# Altium project sub_button.PrjPcb
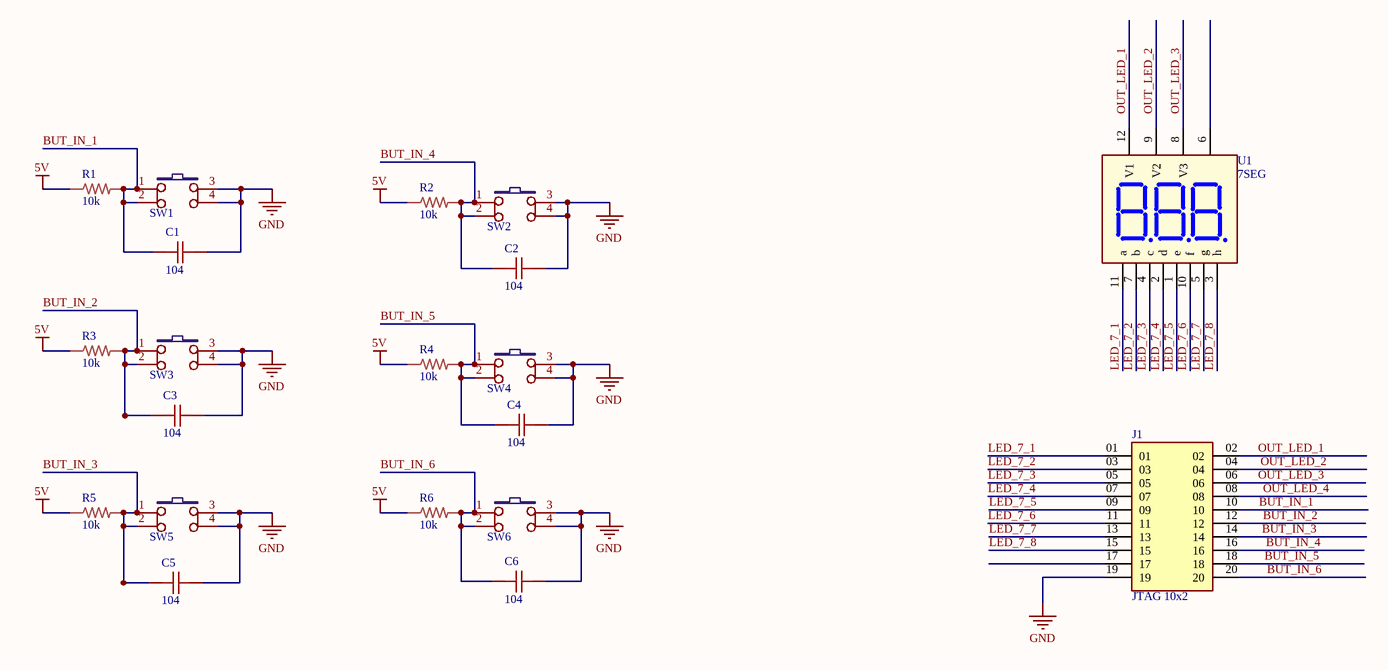
[diagram p0: SCH_SUB_BUTTON.SchDoc]
1 sheet, 20 parts. Net scope: global (net labels, ports and power ports of the same name join across sheets).
Board file: PCB_SUB_BUTTON.PcbDoc

## Sheet SCH_SUB_BUTTON.SchDoc
size A3

### Parts
C1  value 104  [CAP_SMD_1206]  (hidden comment: Cap_SMD)
C2  value 104  [CAP_SMD_1206]  (hidden comment: Cap_SMD)
C3  value 104  [CAP_SMD_1206]  (hidden comment: Cap_SMD)
C4  value 104  [CAP_SMD_1206]  (hidden comment: Cap_SMD)
C5  value 104  [CAP_SMD_1206]  (hidden comment: Cap_SMD)
C6  value 104  [CAP_SMD_1206]  (hidden comment: Cap_SMD)
J1  JTAG 10x2  [JTAG]
R1  value 10k  [Res_SMD_1206]  (hidden comment: Res_SMD)
R2  value 10k  [Res_SMD_1206]  (hidden comment: Res_SMD)
R3  value 10k  [Res_SMD_1206]  (hidden comment: Res_SMD)
R4  value 10k  [Res_SMD_1206]  (hidden comment: Res_SMD)
R5  value 10k  [Res_SMD_1206]  (hidden comment: Res_SMD)
R6  value 10k  [Res_SMD_1206]  (hidden comment: Res_SMD)
SW1  Button6x6  [Button6x6smd]  (value not drawn)
SW2  Button6x6  [Button6x6smd]  (value not drawn)
SW3  Button6x6  [Button6x6smd]  (value not drawn)
SW4  Button6x6  [Button6x6smd]  (value not drawn)
SW5  Button6x6  [Button6x6smd]  (value not drawn)
SW6  Button6x6  [Button6x6smd]  (value not drawn)
U1  7SEG  [7SEG]

### Nets
5V: R1.1 R2.1 R3.1 R4.1 R5.1 R6.1
GND: C1.1 C2.1 C3.1 C4.1 C5.1 C6.1 J1.19 SW1.3 SW1.4 SW2.3 SW2.4 SW3.3 SW3.4 SW4.3 SW4.4 SW5.3 SW5.4 SW6.3 SW6.4
BUT_IN_1: C1.2 J1.10 R1.2 SW1.1 SW1.2
BUT_IN_2: C3.2 J1.12 R3.2 SW3.1 SW3.2
BUT_IN_3: C5.2 J1.14 R5.2 SW5.1 SW5.2
BUT_IN_4: C2.2 J1.16 R2.2 SW2.1 SW2.2
BUT_IN_5: C4.2 J1.18 R4.2 SW4.1 SW4.2
BUT_IN_6: C6.2 J1.20 R6.2 SW6.1 SW6.2
LED_7_1: J1.01 U1.11(a)
LED_7_2: J1.03 U1.7(b)
LED_7_3: J1.05 U1.4(c)
LED_7_4: J1.07 U1.2(d)
LED_7_5: J1.09 U1.1(e)
LED_7_6: J1.11 U1.10(f)
LED_7_7: J1.13 U1.5(g)
LED_7_8: J1.15 U1.3(h)
OUT_LED_1: J1.02 U1.12(V1)
OUT_LED_2: J1.04 U1.9(V2)
OUT_LED_3: J1.06 U1.8(V3)
OUT_LED_4: J1.08

Not connected (* = marked no-connect by the designer): J1 17; U1 6(V4)

### Notes on the sheet
- Title
- Size:
- Date:
- A3
- Number:
- Time:
- Revision:
- Sheet
- of
- File:

### Library data of the parts
C1-C6 = Cap_SMD: Cap SMD multiple types as 0402 0603 0805 1206
J1 = JTAG 10x2: Connector Header Through Hole 20 position 0.100 (2.54mm); MP: TSS-110-01-G-D; MF: Samtec; Package: None; SnapEDA_Link: https://www.snapeda.com/parts/TSS-110-01-G-D/Samtec%20Inc./view-part/930553/?ref=snap; Value: *; Availability: Bad; Toby_UK-Purchase-URL: https://snapeda.com/shop?store=Toby+UK&id=930553; Price: None
R1-R6 = Res_SMD: res smd
SW1-SW6 = Button6x6: button 6x6 mm
U1 = LED 7SEG: Three 7 Seg Dipslay; Value: LED 7Q SEG